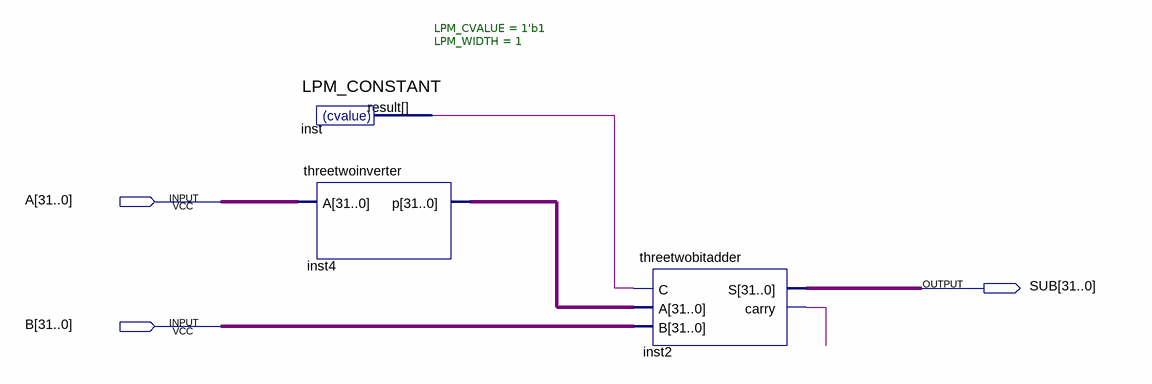
[diagram p0: schematic sheet]
// Quartus schematic threetwosubtracter.bdf as structural Verilog: 3 symbols, 3 pins
module threetwosubtracter (
  input  [31:0] A,
  input  [31:0] B,
  output [31:0] SUB
);

  wire inst2_carry, inst_result;
  wire [31:0] inst4_p;

  LPM_CONSTANT #(.LPM_CVALUE(1'b1), .LPM_WIDTH(1)) inst (.result(inst_result));
  threetwoinverter inst4 (.A(A), .p(inst4_p));
  threetwobitadder inst2 (.C(inst_result), .A(inst4_p), .B(B), .S(SUB), .carry(inst2_carry));
endmodule
